# Altium schematic sheet FAKRA connector.SchDoc: =ProjectTitle
size A3; Author: Jaime I. Chait; Organization: NWES LLC; Address1: 111 SW 5th Ave, STE 3150; Address2: Portland, OR 97204; SheetNumber: 17; SheetTotal: 19
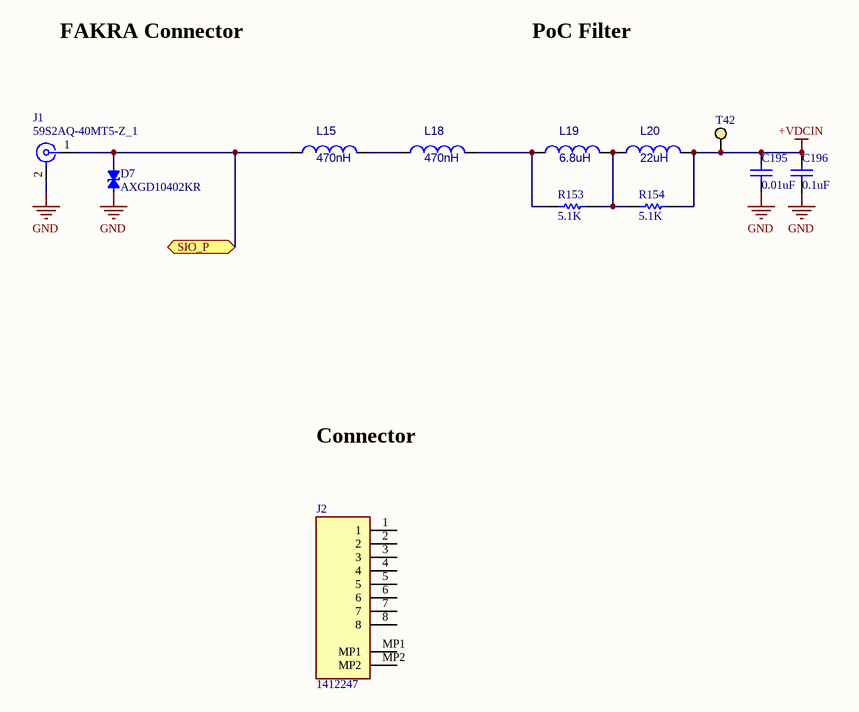
[diagram p0: FAKRA connector.SchDoc]

## Parts
C195  0.01uF  [CAPC1005X55USR]
C196  0.1uF  [CAPC1005X55USR]
D7  AXGD10402KR  [D_0402_1005Metric]
J1  59S2AQ-40MT5-Z_1  [Conn_FAKRA_59S2AQ-40MT5-Z_1]
J2  1412247  [CONN_Phoenix Contact_1412247]
L15  470nH  [PFL1609471MEW]
L18  470nH  [PFL1609471MEW]
L19  6.8uH  [IND_1210POC]
L20  22uH  [IND_MSS6132T]
R153  5.1K  [RESC1005X40USR]
R154  5.1K  [RESC1005X40USR]
T42  TP_S  [TP 1mm]  (value not drawn)  (no BOM)

## Ports
SIO_P (bidir)

## Nets
+VDCIN: C195.2 C196.1 L20.2 R154.2 T42.1
GND: C195.1 C196.2 D7.2(A) J1.2
SIO_P: D7.1(C) J1.1 L15.1 ; port SIO_P
NetL15_2: L15.2 L18.1
NetL18_2: L18.2 L19.1 R153.1
NetL19_2: L19.2 L20.1 R153.2 R154.1

Not connected (* = marked no-connect by the designer): J1 3 4 5; J2 1 2 3 4 5 6 7 8 MP1 MP2

## Notes on the sheet
- FAKRA Connector
- PoC Filter
- Connector
- Title
- Size:
- Date:
- A4
- Number:
- Time:
- Revision:
- Sheet
- of
- File:

## Library data of the parts
C195 = CAP CER 0.01uF 50V X7R 0402: CAP CER 10000PF 50V X7R 0402; Manufacturer Part Number: GCM155R71H103KA55D; Manufacturer: Murata Electronics; Supplier Part Number 1: 490-4762-1-ND; Package: 0402; Height: 0.55mm; Supplier 1: Digi-Key; value: 0.01uF
C196 = CAP CER 0.1UF 25V X5R 0402: Manufacturer Part Number: CL05A104KA5NNNC; Manufacturer: Samsung Electro-Mechanics; Supplier Part Number 1: 1276-1043-1-ND; Package: 0402; Height: 0.55mm; Supplier 1: Digi-Key; value: 0.1uF
D7 = DIODE TVS 40VC 0402: ESD Suppressor Diode TVS Bi-Dir 24V Automotive 2-Pin Case 0402(1006Metric) T/R; Manufacturer: Littelfuse; Number of Bidirectional Channels: 1; Power Line Protection: No; Diode Type: ZENER; Supplier 1: Digikey; Supplier Part Number 1: F10019CT-ND; Manufacturer Part Number: AXGD10402KR; RoHS: Yes; Category: TVS Diodes; Stock: 44275; Pricing: 1=0.49, 10=0.356, 100=0.242, 500=0.19, 1000=0.152, 2000=0.146, 5000=0.14 (USD); Mounting Technology: Surface Mount; Case/Package: 0402; Case Code (Imperial): 0402; Case Code (Metric): 1005; Min Operating Temperature: -65°C; Max Operating Temperature: 125°C; Packaging: Cut Tape; Series: Automotive, AEC-Q200, XTREME-GUARD™; RoHS Compliant: Yes; ComponentLink1URL: https://media.digikey.com/pdf/Data%20Sheets/Littelfuse%20PDFs/AXGD1_Series.pdf?src-supplier=Digikey; ComponentLink1Description: https://media.digikey.com/pdf/Data%20Sheets/Littelfuse%20PDFs/AXGD1_Series.pdf?src-supplier=Digikey; ComponentLink2URL: https://datasheet.octopart.com/AXGD10402KR-Littelfuse-datasheet-102879905.pdf?src-supplier=Element14; ComponentLink2Description: https://datasheet.octopart.com/AXGD10402KR-Littelfuse-datasheet-102879905.pdf?src-supplier=Element14; ComponentLink3URL: https://datasheet.octopart.com/AXGD10402KR-Littelfuse-datasheet-170671804.pdf?src-supplier=Future+Electronics; ComponentLink3Description: https://datasheet.octopart.com/AXGD10402KR-Littelfuse-datasheet-170671804.pdf?src-supplier=Future+Electronics
J1 = Conn_FAKRA_59S2AQ-40MT5-Z_1: Right Angle Plug Pcb W/housin; Manufacturer: Rosenberger; Supplier 1: Mouser; Supplier Part Number 1: 476-59S2AQ-40MT5-Z_1; Manufacturer Part Number: 59S2AQ-40MT5-Z_1; RoHS: Yes; Category: RF / Coaxial Connectors; Stock: 5980; Pricing: 1=2.6, 10=2.37, 50=2.37, 100=2.09, 1000=1.5, 10000=1.35 (USD); RoHS Compliant: Yes
J2 = CONN_1412247: Circular connector; Insert; Female Sockets; 8 position; M8-8; 30V; Manufacturer: Phoenix Contact; Number of Positions: 8; Ratings: IP67,Waterproof,Dust Tight; Supplier 1: Digikey; Supplier Part Number 1: 277-10264-2-ND; Manufacturer Part Number: 1412247; RoHS: Yes; Category: Circular Connectors; Pricing: 100=9.09 (USD); Mounting Technology: Surface Mount; Pins: 8; Contact Material: Copper; Contact Finish - Mating: GOLD; Min Operating Temperature: -55°C; Max Operating Temperature: 105°C; Packaging: Cut Tape; Series: SACC; Termination: Solder; Voltage Rating (AC): 30V; Flammability Rating: UL94 V-0; ComponentLink1URL: https://media.digikey.com/pdf/Data%20Sheets/Phoenix%20Contact%20PDFs/1412247.pdf?src-supplier=Digikey; ComponentLink1Description: https://media.digikey.com/pdf/Data%20Sheets/Phoenix%20Contact%20PDFs/1412247.pdf?src-supplier=Digikey
L15 L18 = POWER INDUCTOR, SHIELDED, 20% TO: Power inductor, shielded, 20% tol, SMT, RoHS, halogen f; Manufacturer: Coilcraft; Manufacturer Part Number: PFL1609-471MEW; Core Material: Composite; Self Resonant Frequency: 650MHz; Max DC Current: 1.3A; Test Frequency: 7.9MHz; Supplier 1: Mouser; Supplier Part Number 1: 994-PFL1609-471MEW; RoHS: Yes; Category: Fixed Inductors; Stock: 2458; Pricing: 1=0.72, 10=0.72, 50=0.72, 100=0.7, 1000=0.536, 10000=0.515 (USD); Min Operating Temperature: -40°C; Max Operating Temperature: 85°C; Packaging: Tape and Reel; Tolerance: 20%; Shielding: Shielded; Value: 470nH; Termination: SMD/SMT; Series: PFL1609; Length: 1.8mm; Width: 1.07mm; Height: 0.95mm; Lead Free: Contains Lead; RoHS Compliant: Yes; ComponentLink1URL: http://www.mouser.com/ds/2/597/pfl1609-270712.pdf?src-supplier=Mouser; ComponentLink1Description: http://www.mouser.com/ds/2/597/pfl1609-270712.pdf?src-supplier=Mouser
L19 = Power Injection Chokes for PoC: Power Injection Chokes for PoC 6.8uH/1A; Manufacturer: Coilcraft; Manufacturer Part Number: 1210POC-682; RoHS: Yes; Category: Fixed Inductors; RoHS Compliant: Yes; Inductance: 6.8uH
L20 = FIXED IND 22UH 1.9A 158MOHM SM: Power Inductor, shielded, ferrite core, 20% tol, SMT, RoHS; Manufacturer: Coilcraft; Manufacturer Part Number: MSS6132T-223MLC; Supplier 1: Mouser; Supplier Part Number 1: 994-MSS6132T-223MLC; RoHS: Yes; Category: Fixed Inductors; Stock: 1738; Pricing: 1=2.13, 10=2.13, 50=2.13, 100=2.13, 1000=0.854, 10000=0.837 (USD); RoHS Compliant: Yes; ComponentLink1URL: https://datasheet.octopart.com/MSS6132T-223MLC-Coilcraft-datasheet-96966862.pdf?src-supplier=Coilcraft+Direct; ComponentLink1Description: https://datasheet.octopart.com/MSS6132T-223MLC-Coilcraft-datasheet-96966862.pdf?src-supplier=Coilcraft+Direct
R153 R154 = RES 5.1K OHM 1% 1/16W 0402: Manufacturer Part Number: RC0402FR-075K1L; Manufacturer: YAGEO; Supplier Part Number 1: 311-5.10KLRCT-ND; Supplier 1: Digi-Key; Height: 0.4mm; Package: 0402; value: 5.1K
T42 = Test point PAD: test point